# Altium schematic sheet Power Supply.SchDoc: Power supply
size A4; Engineer: M.GUENI
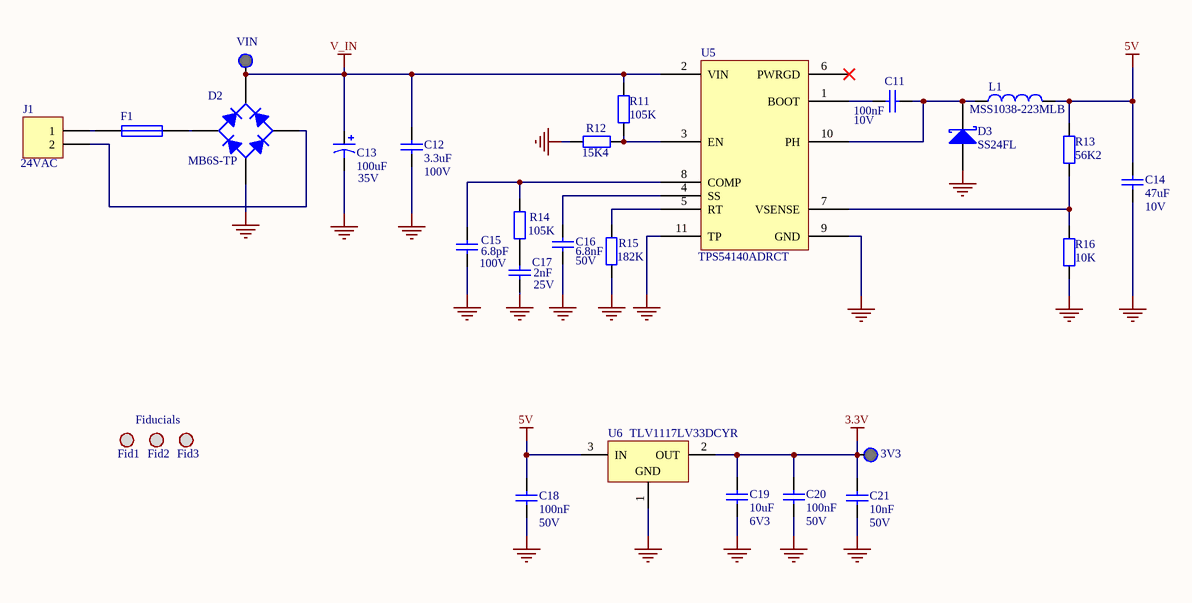
[diagram p0: Power Supply.SchDoc]

## Parts
3V3  Test Point  [TP]  (value not drawn)  (no BOM)
C11  Value 1: 100nF  Value 2: 10V  [CAPC1608N]  (hidden comment: Capacitor)
C12  Value 1: 3.3uF  Value 2: 100V  [CAPC3216N]  (hidden comment: Capacitor)
C13  Value 1: 100uF  Value 2: 35V  [ECAP_SMD_6.3]  (hidden comment: Polarized Capacitor)
C14  Value 1: 47uF  Value 2: 10V  [CAPC2012N]  (hidden comment: Capacitor)
C15  Value 1: 6.8pF  Value 2: 100V  [CAPC1608N]  (hidden comment: Capacitor)
C16  Value 1: 6.8nF  Value 2: 50V  [CAPC1608N]  (hidden comment: Capacitor)
C17  Value 1: 2nF  Value 2: 25V  [CAPC2012N]  (hidden comment: Capacitor)
C18  Value 1: 100nF  Value 2: 50V  [CAPC1608N]  (hidden comment: Capacitor)
C19  Value 1: 10uF  Value 2: 6V3  [CAPC2012N]  (hidden comment: Capacitor)
C20  Value 1: 100nF  Value 2: 50V  [CAPC1608N]  (hidden comment: Capacitor)
C21  Value 1: 10nF  Value 2: 50V  [CAPC1608N]  (hidden comment: Capacitor)
D2  MB6S-TP  [MB6S]
D3  SS24FL  [SOD-123F]
F1  0452.500NRL  [Fuse_NANO2]  (value not drawn)
Fid1  Fiducial  [FIDUCIAL-1MM]  (value not drawn)
Fid2  Fiducial  [FIDUCIAL-1MM]  (value not drawn)
Fid3  Fiducial  [FIDUCIAL-1MM]  (value not drawn)
J1  24VAC  [CUI_TB007-508-02BE]
L1  MSS1038-223MLB  [MSS1038]
R11  Value 1: 105K  [RESC1608N]  (hidden comment: Resistor)
R12  Value 1: 15K4  [RESC1608N]  (hidden comment: Resistor)
R13  Value 1: 56K2  [RESC1608N]  (hidden comment: Resistor)
R14  Value 1: 105K  [RESC1608N]  (hidden comment: Resistor)
R15  Value 1: 182K  [RESC1608N]  (hidden comment: Resistor)
R16  Value 1: 10K  [RESC1608N]  (hidden comment: Resistor)
U5  TPS54140ADRCT  [VSON-10]
U6  TLV1117LV33DCYR  [SOT223]
VIN  Test Point  [TP]  (value not drawn)  (no BOM)

## Nets
3.3V: 3V3.1 C19.2 C20.2 C21.2 U6.2(OUT)
5V: C14.2 C18.2 L1.2 R13.2 U6.3(IN)
GND: C12.1 C13.2 C14.1 C15.1 C16.1 C17.1 C18.1 C19.1 C20.1 C21.1 D2.3(A) D3.1(A) R12.1 R15.1 R16.1 U5.9(GND) U5.11(TP) U6.1(GND)
V_IN: C12.2 C13.1 D2.1(K) R11.2 U5.2(VIN) VIN.1
NetC11_1: C11.1 U5.1(BOOT)
NetC11_2: C11.2 D3.2(K) L1.1 U5.10(PH)
NetC15_2: C15.2 R14.2 U5.8(COMP)
NetC16_2: C16.2 U5.4(SS)
NetC17_2: C17.2 R14.1
NetD2_2: D2.2(C) J1.2
NetD2_4: D2.4(C) F1.2
NetF1_1: F1.1 J1.1
NetR11_1: R11.1 R12.2 U5.3(EN)
NetR13_1: R13.1 R16.2 U5.7(VSENSE)
NetR15_2: R15.2 U5.5(RT)

Not connected (* = marked no-connect by the designer): U5 6(PWRGD)*

## Notes on the sheet
- Fiducials

## Library data of the parts
3V3 VIN = MIS-000000003: MAN: _; Part Number: MIS-000000003; MANREF: _; DES: _; Value 1: _; Value 2: _; TOL: _; FTP: _; SUP: _; SUPREF: _; NOTE: _
C11 = CAP-000000005: MAN: KEMET; MANREF: C0603X104K8RACTU; DES: C0603X104K8RACTU -  Condensateur céramique multicouche CMS, 0.1 µF, 10 V, 0603 [1608 Metric], ± 10%, X7R; TOL: 10%; FTP: 0603; SUP: Farnell; SUPREF: 2904937; NOTE: _; Part Number: CAP-000000005
C12 = CAP-000000009: MAN: TDK; MANREF: C3216X7S2A335M160AB; DES: C3216X7S2A335M160AB -  Condensateur céramique multicouche CMS, 3.3 µF, 100 V, 1206 [3216 Metric], ± 20%, X7S, C Series TDK; TOL: 20%; FTP: 1206; SUP: Farnell; SUPREF: 2526280; NOTE: _; Part Number: CAP-000000009
C13 = CAP-000000001: MAN: PANASONIC; MANREF: EEEFK1V101XP; DES: PANASONIC ELECTRONIC COMPONENTS  EEEFK1V101XP  CONDENSATEUR ELEC ALU 100UF 35V CMS; TOL: 20%; FTP: SMD Size D8; SUP: Farnell; SUPREF: 1850114; NOTE: _; Part Number: CAP-000000001
C14 = CAP-000000004: MAN: MURATA; MANREF: GRM21BR61A476ME15L; DES: GRM21BR61A476ME15L -  Condensateur céramique multicouche CMS, 47 µF, 10 V, 0805 [2012 Metric], ± 20%, X5R, GRM Series; TOL: 20%; FTP: 0805; SUP: Farnell; SUPREF: 2611939; NOTE: _; Part Number: CAP-000000004
C15 = CAP-000000008: MAN: AVX; MANREF: 06031U6R8BAT2A; DES: Multilayer Ceramic Capacitors MLCC - SMD/SMT 100V 6.8pF C0G 0603 .1pF Tol; TOL: _; FTP: 0603; SUP: Mouser; SUPREF: 581-06031U6R8BAT2A; Part Number: CAP-000000008; NOTE: _
C16 = CAP-000000006: MAN: KEMET; MANREF: C0603X682K5GECAUTO; DES: C0603X682K5GECAUTO -  Condensateur céramique multicouche CMS, ESD, AEC-Q200, 6800 pF, 50 V, 0603 [1608 Metric], ± 10%; TOL: 10%; FTP: 0603; SUP: Farnell; SUPREF: 2760504; NOTE: _; Part Number: CAP-000000006
C17 = CAP-000000007: MAN: KEMET; MANREF: C0805C202J3GACTU; DES: C0805C202J3GACTU -  Condensateur céramique multicouche CMS, 2000 pF, 25 V, 0805 [2012 Metric], ± 5%, C0G / NP0; TOL: 5%; FTP: 0805; SUP: Farnell; SUPREF: 2905236; NOTE: _; Part Number: CAP-000000007
C18 C20 = CAP-000000002: MAN: VISHAY; MANREF: VJ0603V104ZXAPW1BC; DES: VJ0603V104ZXAPW1BC -  Condensateur céramique multicouche CMS, 0.1 µF, 50 V, 0603 [1608 Metric], +80%, -20%, Y5V; TOL: +80% -20%; FTP: 0603; SUP: Farnell; SUPREF: 2896408; NOTE: _; Part Number: CAP-000000002
C19 = CAP-000000001: MAN: MULTICOMP; MANREF: MCTT21X106M6R3CT; DES: MCTT21X106M6R3CT -  Condensateur céramique multicouche CMS, 10 µF, 6.3 V, 0805 [2012 Metric], ± 20%, X5R, Série MCTT; TOL: 20%; FTP: 0805; SUP: Farnell; SUPREF: 1759476; NOTE: _; Part Number: CAP-000000001
C21 = CAP-000000003: MAN: MULTICOMP; MANREF: 06035C103JAT2A; DES: 06035C103JAT2A -  Condensateur céramique multicouche CMS, 10000 pF, 50 V, 0603 [1608 Metric], ± 5%, X7R; TOL: 5%; FTP: 0603; SUP: Farnell; SUPREF: 1833871; NOTE: _; Part Number: CAP-000000003
D2 = DIB-000000001: MAN: Micro Commercial Components (MCC); DES: Redresseurs en pont .5A 600V; Value 1: 0.5A; Value 2: 600V; TOL: _; FTP: MBS-1; SUP: Mouser; SUPREF: 833-MB6S-TP; Part Number: DIB-000000001; MANREF: MB6S-TP; NOTE: _
D3 = DIS-000000002: MAN: ON Semiconductor / Fairchild; DES: Schottky Diodes & Rectifiers 40V, 2A SCHOTTKY; Value 1: 2A; Value 2: 40V; TOL: _; FTP: SOD-123-2; SUP: Mouser; SUPREF: 512-SS24FL; Part Number: DIS-000000002; MANREF: SS24FL; NOTE: _
F1 = FUS-000000002: MAN: LITTELFUSE; DES: 0452.500NRL -  Fusible / Montage en surface, Série NANO2, 500 mA, 125 VAC, 32 VDC, Temporisé, CMS; Value 1: 500mA; Value 2: 32VDC; TOL: _; SUP: Farnell; SUPREF: 9922326; Part Number: FUS-000000002; MANREF: 0452.500NRL; FTP: _; NOTE: _
Fid1-Fid3 = MIS-000000004: MAN: _; Value 1: 1mm; Part Number: MIS-000000004; MANREF: _; DES: _; Value 2: _; TOL: _; FTP: _; SUP: _; SUPREF: _; NOTE: _
J1 = CON-000000001: MAN: CUI Devices; MANREF: TB007-508-02BE / 39910-0102; DES: Fixed Terminal Blocks Terminal block, screw type, 5.08 , horizontal, 2 poles, CUI Blue, slotted screw, PCB mount; Value 1: 2pts; Value 2: 5.08 mm; TOL: _; FTP: THT; SUP: Mouser; SUPREF: 490-TB007-508-02BE; Part Number: CON-000000001; NOTE: _
L1 = IND-000000001: MAN: Coilcraft; DES: Fixed Inductors MSS1038 SMT Shielded 22 uH 20 % 2.85 A; Value 1: 22uH; Value 2: 2.85A; TOL: 20%; FTP: _; SUP: Mouser; SUPREF: 994-MSS1038-223MLB; Part Number: IND-000000001; MANREF: MSS1038-223MLB; NOTE: _
R11 R14 = RES-000000003: MAN: PANASONIC ELECTRONIC COMPONENT; MANREF: ERJ3EKF1053V; DES: ERJ3EKF1053V -  Résistance à puce CMS, Couche épaisse, 105 kohm, Série ERJ3E, 75 V, Couche épaisse; Value 2: 0.1W; TOL: 1%; FTP: 0603; SUP: Farnell; SUPREF: 2059494; NOTE: _; Part Number: RES-000000003
R12 = RES-000000002: MAN: MULTICOMP; MANREF: MCMR06X1542FTL; DES: MCMR06X1542FTL -  Résistance à puce CMS, Céramique, 15.4 kohm, Série MCMR, 75 V, Couche épaisse, 0603 [1608 Metric]; Value 2: 0.1W; TOL: 1%; FTP: 0603; SUP: Farnell; SUPREF: 2073397; NOTE: _; Part Number: RES-000000002
R13 = RES-000000005: MAN: MULTICOMP; MANREF: MCWR06X5622FTL; DES: MCWR06X5622FTL -  Résistance à puce CMS, 56.2 kohm, MCWR06 Series, 75 V, Couche épaisse, 0603 [1608 Metric], 100 mW; Value 2: 0.1W; TOL: 1%; FTP: 0603; SUP: Farnell; SUPREF: 2694903; NOTE: _; Part Number: RES-000000005
R15 = RES-000000004: MAN: PANASONIC ELECTRONIC COMPONENTS; MANREF: ERJ3EKF1823V; DES: ERJ3EKF1823V -  Résistance à puce CMS, Couche épaisse, 182 kohm, Série ERJ3E, 75 V, Couche épaisse; Value 2: 0.1W; TOL: 1%; FTP: 0603; SUP: Farnell; SUPREF: 2059508; NOTE: _; Part Number: RES-000000004
R16 = RES-000000001: MAN: YAGEO; MANREF: RC0603FR-0710KL; DES: YAGEO (PHYCOMP)  RC0603FR-0710KL  RESISTANCE COUCHE EPAISSE 10K 0.1W 1%; Value 2: 0.1W; TOL: 1%; FTP: 0603; SUP: Farnell; SUPREF: 9238603; NOTE: _; Part Number: RES-000000001
U5 = ICP-000000006: MAN: Texas Instruments; DES: Switching Voltage Regulators 3.5-42Vin,1.5A SD Converter; Value 1: _; SUP: Mouser; SUPREF: 595-TPS54140ADRCT; Part Number: ICP-000000006; MANREF: TPS54140ADRCT; Value 2: _; TOL: _; FTP: VSON-10; NOTE: _
U6 = VRG-000000001: MAN: Texas Instrument; DES: TEXAS INSTRUMENTS  TLV1117LV33DCYR  LDO FIXE 3.3V 1A SOT-223-4; Value 1: 3.3V; Value 2: 1A; TOL: _; FTP: SOT-223; SUP: Mouser; SUPREF: 595-TLV1117LV33DCYR; Part Number: VRG-000000001; MANREF: TLV1117LV33DCYR; NOTE: _